# EAGLE design LED Debug - CRBFH0 (EAGLE 9.2.2)
LICENSE: CERN OHL; REV: CRBFH0; TITLE: LED Debug; URL: https://github.com/CapableRobot/PMOD-Adapters
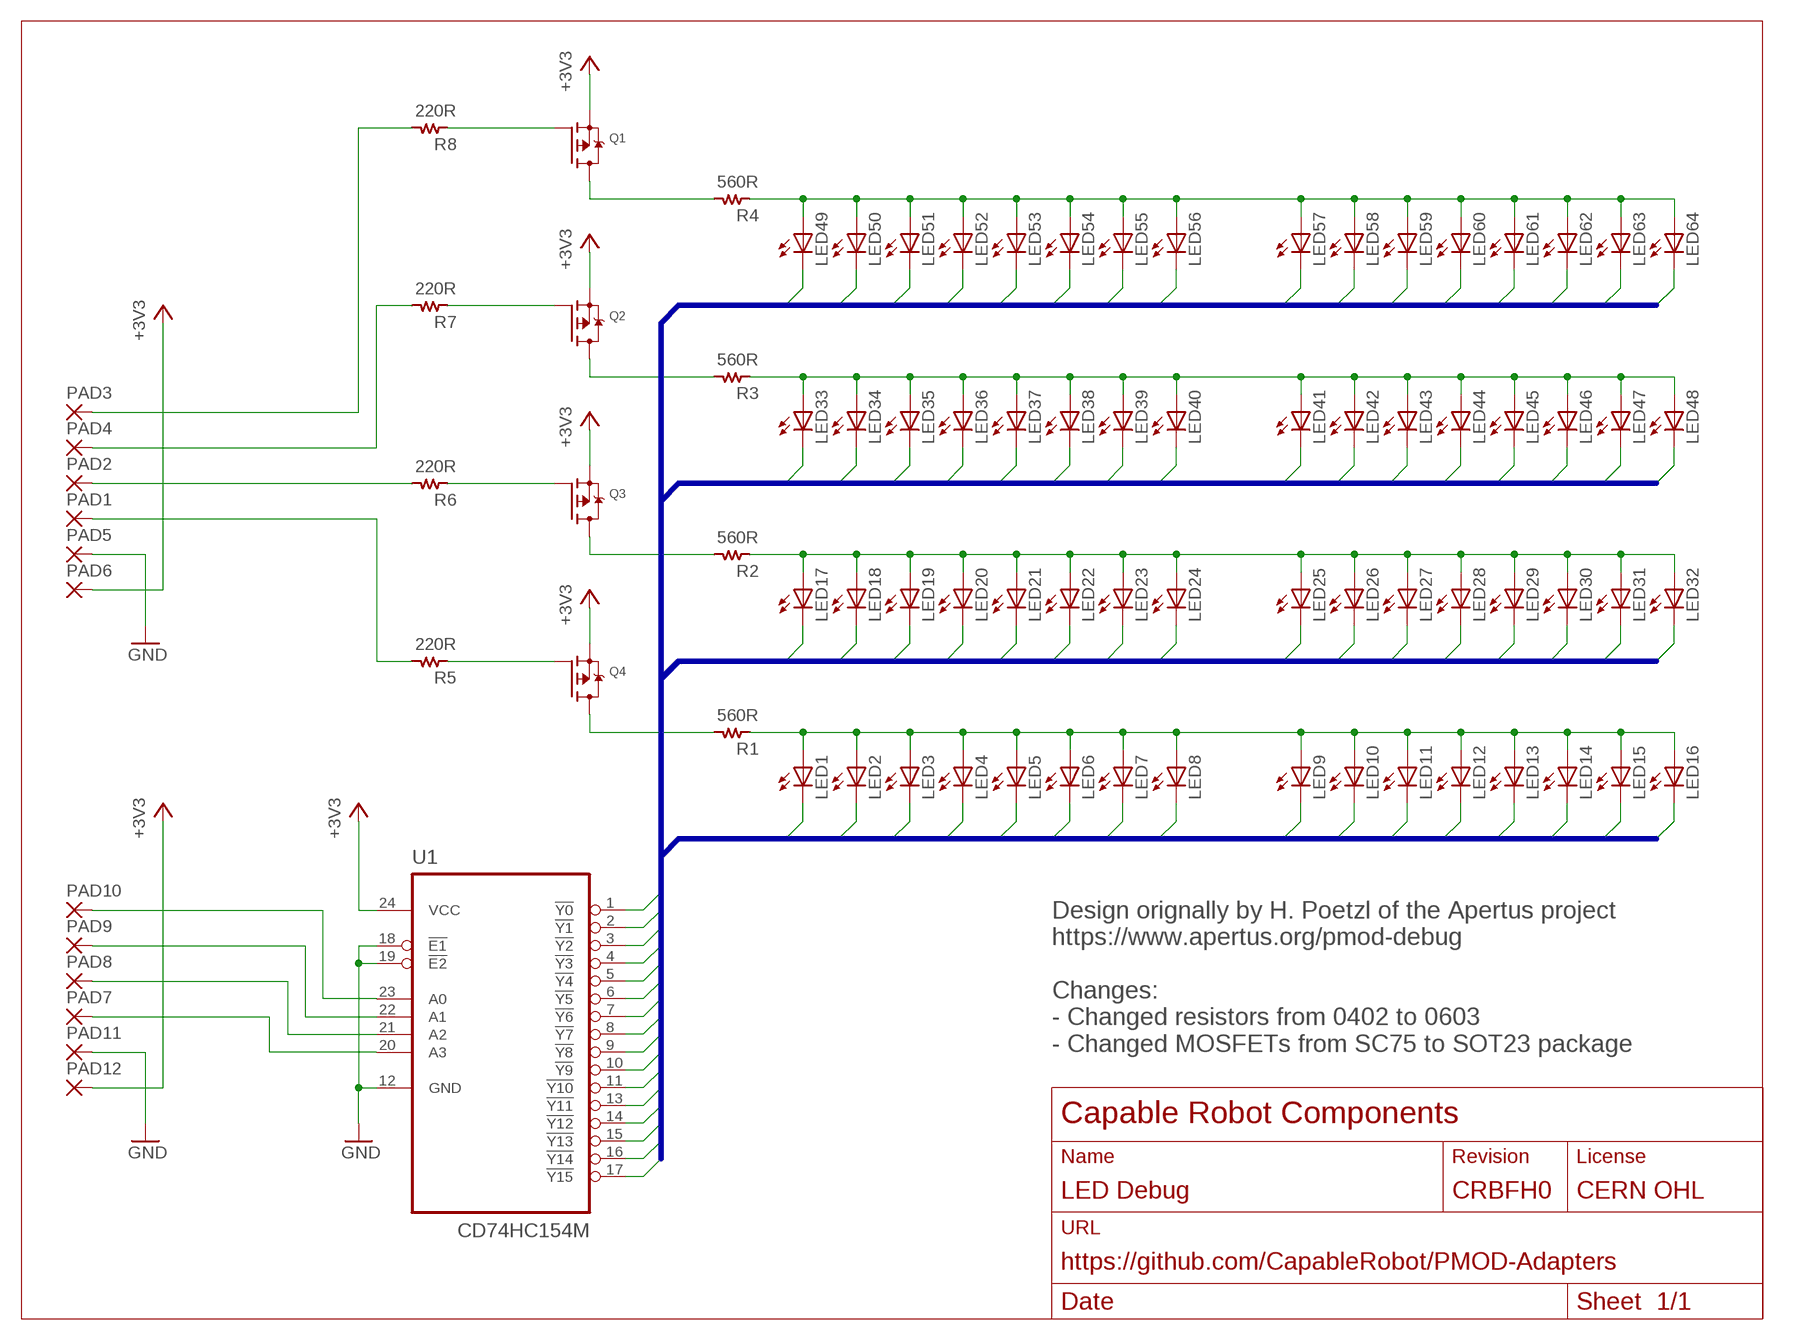
[diagram p0: schematic, sheet 1]

## Parts
LED1  LEDCHIP-LED0603  [CHIP-LED0603]
LED2  LEDCHIP-LED0603  [CHIP-LED0603]
LED3  LEDCHIP-LED0603  [CHIP-LED0603]
LED4  LEDCHIP-LED0603  [CHIP-LED0603]
LED5  LEDCHIP-LED0603  [CHIP-LED0603]
LED6  LEDCHIP-LED0603  [CHIP-LED0603]
LED7  LEDCHIP-LED0603  [CHIP-LED0603]
LED8  LEDCHIP-LED0603  [CHIP-LED0603]
LED9  LEDCHIP-LED0603  [CHIP-LED0603]
LED10  LEDCHIP-LED0603  [CHIP-LED0603]
LED11  LEDCHIP-LED0603  [CHIP-LED0603]
LED12  LEDCHIP-LED0603  [CHIP-LED0603]
LED13  LEDCHIP-LED0603  [CHIP-LED0603]
LED14  LEDCHIP-LED0603  [CHIP-LED0603]
LED15  LEDCHIP-LED0603  [CHIP-LED0603]
LED16  LEDCHIP-LED0603  [CHIP-LED0603]
LED17  LEDCHIP-LED0603  [CHIP-LED0603]
LED18  LEDCHIP-LED0603  [CHIP-LED0603]
LED19  LEDCHIP-LED0603  [CHIP-LED0603]
LED20  LEDCHIP-LED0603  [CHIP-LED0603]
LED21  LEDCHIP-LED0603  [CHIP-LED0603]
LED22  LEDCHIP-LED0603  [CHIP-LED0603]
LED23  LEDCHIP-LED0603  [CHIP-LED0603]
LED24  LEDCHIP-LED0603  [CHIP-LED0603]
LED25  LEDCHIP-LED0603  [CHIP-LED0603]
LED26  LEDCHIP-LED0603  [CHIP-LED0603]
LED27  LEDCHIP-LED0603  [CHIP-LED0603]
LED28  LEDCHIP-LED0603  [CHIP-LED0603]
LED29  LEDCHIP-LED0603  [CHIP-LED0603]
LED30  LEDCHIP-LED0603  [CHIP-LED0603]
LED31  LEDCHIP-LED0603  [CHIP-LED0603]
LED32  LEDCHIP-LED0603  [CHIP-LED0603]
LED33  LEDCHIP-LED0603  [CHIP-LED0603]
LED34  LEDCHIP-LED0603  [CHIP-LED0603]
LED35  LEDCHIP-LED0603  [CHIP-LED0603]
LED36  LEDCHIP-LED0603  [CHIP-LED0603]
LED37  LEDCHIP-LED0603  [CHIP-LED0603]
LED38  LEDCHIP-LED0603  [CHIP-LED0603]
LED39  LEDCHIP-LED0603  [CHIP-LED0603]
LED40  LEDCHIP-LED0603  [CHIP-LED0603]
LED41  LEDCHIP-LED0603  [CHIP-LED0603]
LED42  LEDCHIP-LED0603  [CHIP-LED0603]
LED43  LEDCHIP-LED0603  [CHIP-LED0603]
LED44  LEDCHIP-LED0603  [CHIP-LED0603]
LED45  LEDCHIP-LED0603  [CHIP-LED0603]
LED46  LEDCHIP-LED0603  [CHIP-LED0603]
LED47  LEDCHIP-LED0603  [CHIP-LED0603]
LED48  LEDCHIP-LED0603  [CHIP-LED0603]
LED49  LEDCHIP-LED0603  [CHIP-LED0603]
LED50  LEDCHIP-LED0603  [CHIP-LED0603]
LED51  LEDCHIP-LED0603  [CHIP-LED0603]
LED52  LEDCHIP-LED0603  [CHIP-LED0603]
LED53  LEDCHIP-LED0603  [CHIP-LED0603]
LED54  LEDCHIP-LED0603  [CHIP-LED0603]
LED55  LEDCHIP-LED0603  [CHIP-LED0603]
LED56  LEDCHIP-LED0603  [CHIP-LED0603]
LED57  LEDCHIP-LED0603  [CHIP-LED0603]
LED58  LEDCHIP-LED0603  [CHIP-LED0603]
LED59  LEDCHIP-LED0603  [CHIP-LED0603]
LED60  LEDCHIP-LED0603  [CHIP-LED0603]
LED61  LEDCHIP-LED0603  [CHIP-LED0603]
LED62  LEDCHIP-LED0603  [CHIP-LED0603]
LED63  LEDCHIP-LED0603  [CHIP-LED0603]
LED64  LEDCHIP-LED0603  [CHIP-LED0603]
PAD1  SMD2HR  [SMD1.27-3.175HR]
PAD2  SMD2HR  [SMD1.27-3.175HR]
PAD3  SMD2HR  [SMD1.27-3.175HR]
PAD4  SMD2HR  [SMD1.27-3.175HR]
PAD5  SMD2HR  [SMD1.27-3.175HR]
PAD6  SMD2HR  [SMD1.27-3.175HR]
PAD7  SMD2HR  [SMD1.27-3.175HR]
PAD8  SMD2HR  [SMD1.27-3.175HR]
PAD9  SMD2HR  [SMD1.27-3.175HR]
PAD10  SMD2HR  [SMD1.27-3.175HR]
PAD11  SMD2HR  [SMD1.27-3.175HR]
PAD12  SMD2HR  [SMD1.27-3.175HR]
Q1  MOSFET-P  [SOT23-R]
Q2  MOSFET-P  [SOT23-R]
Q3  MOSFET-P  [SOT23-R]
Q4  MOSFET-P  [SOT23-R]
R1  560R  RES0603  [0603]
R2  560R  RES0603  [0603]
R3  560R  RES0603  [0603]
R4  560R  RES0603  [0603]
R5  220R  RES0603  [0603]
R6  220R  RES0603  [0603]
R7  220R  RES0603  [0603]
R8  220R  RES0603  [0603]
U1  CD74HC154M  [SOIC127P1030X265-24N]

## Nets
+3V3: PAD6.1(P) PAD12.1(P) Q1.2(S) Q2.2(S) Q3.2(S) Q4.2(S) U1.24(VCC)
C0: LED1.C LED17.C LED33.C LED49.C U1.1(!Y0)
C1: LED2.C LED18.C LED34.C LED50.C U1.2(!Y1)
C2: LED3.C LED19.C LED35.C LED51.C U1.3(!Y2)
C3: LED4.C LED20.C LED36.C LED52.C U1.4(!Y3)
C4: LED5.C LED21.C LED37.C LED53.C U1.5(!Y4)
C5: LED6.C LED22.C LED38.C LED54.C U1.6(!Y5)
C6: LED7.C LED23.C LED39.C LED55.C U1.7(!Y6)
C7: LED8.C LED24.C LED40.C LED56.C U1.8(!Y7)
C8: LED9.C LED25.C LED41.C LED57.C U1.9(!Y8)
C9: LED10.C LED26.C LED42.C LED58.C U1.10(!Y9)
C10: LED11.C LED27.C LED43.C LED59.C U1.11(!Y10)
C11: LED12.C LED28.C LED44.C LED60.C U1.13(!Y11)
C12: LED13.C LED29.C LED45.C LED61.C U1.14(!Y12)
C13: LED14.C LED30.C LED46.C LED62.C U1.15(!Y13)
C14: LED15.C LED31.C LED47.C LED63.C U1.16(!Y14)
C15: LED16.C LED32.C LED48.C LED64.C U1.17(!Y15)
GND: PAD5.1(P) PAD11.1(P) U1.12(GND) U1.18(!E1) U1.19(!E2)
N$1: LED1.A LED2.A LED3.A LED4.A LED5.A LED6.A LED7.A LED8.A LED9.A LED10.A LED11.A LED12.A LED13.A LED14.A LED15.A LED16.A R1.1
N$2: LED17.A LED18.A LED19.A LED20.A LED21.A LED22.A LED23.A LED24.A LED25.A LED26.A LED27.A LED28.A LED29.A LED30.A LED31.A LED32.A R2.1
N$3: LED33.A LED34.A LED35.A LED36.A LED37.A LED38.A LED39.A LED40.A LED41.A LED42.A LED43.A LED44.A LED45.A LED46.A LED47.A LED48.A R3.1
N$4: LED49.A LED50.A LED51.A LED52.A LED53.A LED54.A LED55.A LED56.A LED57.A LED58.A LED59.A LED60.A LED61.A LED62.A LED63.A LED64.A R4.1
N$5: Q1.3(D) R4.2
N$6: Q2.3(D) R3.2
N$7: Q4.3(D) R1.2
N$8: Q3.3(D) R2.2
N$9: Q1.1(G) R8.1
N$10: Q2.1(G) R7.1
N$11: Q4.1(G) R5.1
N$12: Q3.1(G) R6.1
N$13: PAD10.1(P) U1.23(A0)
N$14: PAD9.1(P) U1.22(A1)
N$15: PAD8.1(P) U1.21(A2)
N$16: PAD7.1(P) U1.20(A3)
N$17: PAD1.1(P) R5.2
N$18: PAD2.1(P) R6.2
N$19: PAD3.1(P) R8.2
N$20: PAD4.1(P) R7.2

## Buses
C[0..15]

## Notes on the sheet
- Design orignally by H. Poetzl of the Apertus project
  https://www.apertus.org/pmod-debug
  
  Changes:
  - Changed resistors from 0402 to 0603
  - Changed MOSFETs from SC75 to SOT23 package

## Library data of the parts
LED1-LED64 = led:LED: LED OSRAM: - CHIPLED LG R971, LG N971, LY N971, LG Q971, LY Q971, LO R971, LY R971 LH N974, LH R974 LS Q976, LO Q976, LY Q976 LO Q996 - Hyper CHIPLED LW Q18S LB Q993, LB Q99A, LB R99A - SideLED LS A670, LO A670, LY A670, LG A670, LP A670 LB A673, LV A673, LT A673, LW A673 LH A674 LY A675 LS A676, LA A676, LO A676, LY A676, LW A676 LS A679, LY A679, LG A679 - Hyper Micro SIDELED® LS Y876, LA Y876, LO Y876, LY Y876 LT Y87S - SmartLED LW L88C, LW L88S LB L89C, LB L89S, LG L890 LS L89K, LO L89K, LY L89K LS L896, LA L896, LO L896, LY L896 - TOPLED LS T670, LO T670, LY T670, LG T670, LP T670 LSG T670, LSP T670, LSY T670, LOP T670, LYG T670 LG T671, LOG T671, LSG T671 LB T673, LV T673, LT T673, LW T673 LH T674 LS T676, LA T676, LO T676, LY T676, LB T676, LH T676, LSB T676, LW T676 LB T67C, LV T67C, LT T67C, LS T67K, LO T67K, LY T67K, LW E67C LS E67B, LA E67B, LO E67B, LY E67B, LB E67C, LV E67C, LT E67C LW T67C LS T679, LY T679, LG T679 LS T770, LO T770, LY T770, LG T770, LP T770 LB T773, LV T773, LT T773, LW T773 LH T774 LS E675, LA E675, LY E675, LS T675 LS T776, LA T776, LO T776, LY T776, LB T776 LHGB T686 LT T68C, LB T68C - Hyper Mini TOPLED® LB M676 - Mini TOPLED Santana® LG M470 LS M47K, LO M47K, LY M47K Source: http://www.osram.convergy.de LUXEON: - LUMILED® LXK2-PW12-R00, LXK2-PW12-S00, LXK2-PW14-U00, LXK2-PW14-V00 LXK2-PM12-R00, LXK2-PM12-S00, LXK2-PM14-U00 LXK2-PE12-Q00, LXK2-PE12-R00, LXK2-PE12-S00, LXK2-PE14-T00, LXK2-PE14-U00 LXK2-PB12-K00, LXK2-PB12-L00, LXK2-PB12-M00, LXK2-PB14-N00, LXK2-PB14-P00, LXK2-PB14-Q00 LXK2-PR12-L00, LXK2-PR12-M00, LXK2-PR14-Q00, LXK2-PR14-R00 LXK2-PD12-Q00, LXK2-PD12-R00, LXK2-PD12-S00 LXK2-PH12-R00, LXK2-PH12-S00 LXK2-PL12-P00, LXK2-PL12-Q00, LXK2-PL12-R00 Source: www.luxeon.com KINGBRIGHT: KA-3528ASYC Source: www.kingbright.com
PAD1-PAD12 = wirepad:SMD2: SMD PAD
Q1-Q4 = microbuilder:MOSFET-P: P-Channel Mosfet LEGEND VDS: Voltage Drain-Source ID: Drain Current RDS(ON): Drain-Source On-State Resistance VGS(TH): Gate-Source Threshold Voltage CISS: Drain-Source Input Capacitance SOT-23 Name VDS ID RDS(ON) VGS(TH) CISS Order Number IRLML5103 30V 760mA 600 mOhm -- 75pF @ 25V Digikey: IRLML5103PBFCT-ND IRLML6401 12V 4.3A 50 mOhm 950mV @ 250µA 830pF @ 10V Digikey: IRLML6401PBFTR-ND NTR0202PL 20V 400mA 800 mOhm 2.3V @ 250uA 70pF @ 5V Digikey: NTR0202PLT1GOSTR-ND NTR4101PT1G 20V 1.8A 85 mOhm 1.2V @ 250uA 675pF @ 10V Digikey: NTR4101PT1GOSCT-ND DMP2004K 20V 600mA 900 mOhm 1V @ 250uA 175pF @ 16V Digikey: DMP2004KDICT-ND PMV65XP 20V 3.9A 76 mOhm 950mV @ 1mA 725pF @ 20V Digikey: 568-2358-2-ND TO-252 Name VDS ID RDS(ON) VGS(TH) CISS Order Number AOD417 30V 25A 34 mOhm 3V @ 250µA 920pF @ 15V Digikey: 785-1106-2-ND
R1-R8 = CapableRobot:RES
U1 = 74hc154:CD74HC154M: High-Speed CMOS Logic 4- to 16-Line Decoder/Demultiplexer; MPN: CD74HC154M; OC_FARNELL: 1640550; OC_NEWARK: 66F5185; PACKAGE: SOIC-24; SUPPLIER: Texas Instruments

## Board
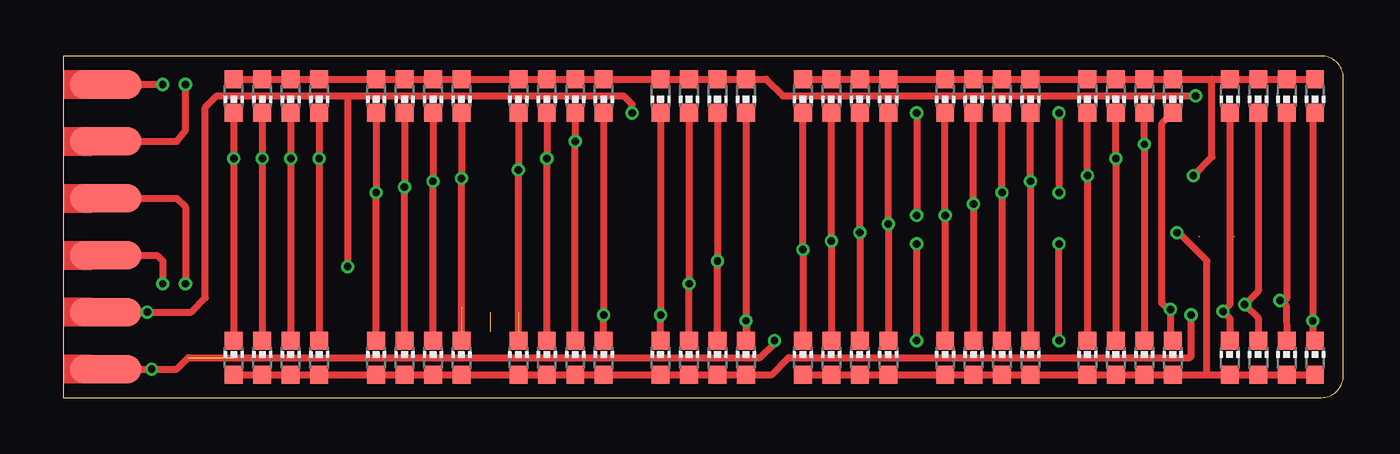
[diagram p1: board, top side]
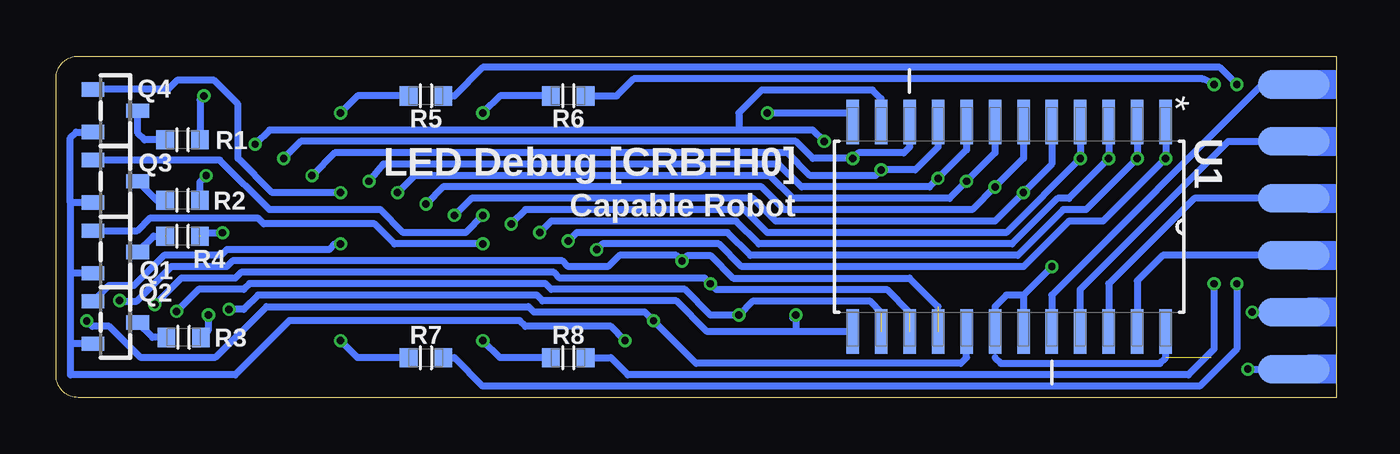
[diagram p2: board, bottom side, seen from below]

Size 57.15 x 15.24 mm. Coordinates in mm from the lower left corner, seen from the top.
Outline: 0,0 56.15,0 arc90 57.15,1 57.15,14.24 arc90 56.15,15.24 0,15.24 0,0
Copper layers (1*16): Top 0.035559375mm / dielectric 1.6mm / Bottom 0.035559375mm
Design rules "oshpark-2layer *": minimum track width 6mil, minimum drill 10mil, track to track 6mil, track to pad 6mil, pad to pad 6mil, via to via 6mil, smd to smd 6mil, copper to edge 15mil, drill to drill 6mil, minimum pad ring 5mil, minimum via ring 5mil, stop-mask expansion 2.5mil, vias tented up to drill 50mil, thermal gap 10mil

### Footprints (pad centres in the part's own frame; a part is rotated, then mirrored left to right if it is on the bottom)
CHIP-LED0603 = smd 0.8 x 0.8: A 0,-0.75; C 0,0.75
SMD1.27-3.175HR = smd 1.27 x 3.175: 1 0,0
SOT23-R = smd 0.635 x 1.016: 1 -0.95,-1; 2 0.95,-1; 3 0,1
0603 = smd 0.79 x 0.86: 1 -0.775,0; 2 0.775,0
SOIC127P1030X265-24N = smd 1.981 x 0.559: 1 -4.674,6.985; 2 -4.674,5.715; 3 -4.674,4.445; 4 -4.674,3.175; 5 -4.674,1.905; 6 -4.674,0.635; 7 -4.674,-0.635; 8 -4.674,-1.905; 9 -4.674,-3.175; 10 -4.674,-4.445; 11 -4.674,-5.715; 12 -4.674,-6.985; 13 4.674,-6.985; 14 4.674,-5.715; 15 4.674,-4.445; 16 4.674,-3.175; 17 4.674,-1.905; 18 4.674,-0.635; 19 4.674,0.635; 20 4.674,1.905; 21 4.674,3.175; 22 4.674,4.445; 23 4.674,5.715; 24 4.674,6.985

### Placement (x,y rotation side)
LED1  7.62,13.46 180 top
LED2  8.89,13.46 180 top
LED3  10.16,13.46 180 top
LED4  11.43,13.46 180 top
LED5  13.97,13.46 180 top
LED6  15.24,13.46 180 top
LED7  16.51,13.46 180 top
LED8  17.78,13.46 180 top
LED9  20.32,13.46 180 top
LED10  21.59,13.46 180 top
LED11  22.86,13.46 180 top
LED12  24.13,13.46 180 top
LED13  26.67,13.46 180 top
LED14  27.94,13.46 180 top
LED15  29.21,13.46 180 top
LED16  30.48,13.46 180 top
LED17  33.02,13.46 180 top
LED18  34.29,13.46 180 top
LED19  35.56,13.46 180 top
LED20  36.83,13.46 180 top
LED21  39.37,13.46 180 top
LED22  40.64,13.46 180 top
LED23  41.91,13.46 180 top
LED24  43.18,13.46 180 top
LED25  45.72,13.46 180 top
LED26  46.99,13.46 180 top
LED27  48.26,13.46 180 top
LED28  49.53,13.46 180 top
LED29  52.07,13.46 180 top
LED30  53.34,13.46 180 top
LED31  54.61,13.46 180 top
LED32  55.88,13.46 180 top
LED33  7.62,1.78 0 top
LED34  8.89,1.78 0 top
LED35  10.16,1.78 0 top
LED36  11.43,1.78 0 top
LED37  13.97,1.78 0 top
LED38  15.24,1.78 0 top
LED39  16.51,1.78 0 top
LED40  17.78,1.78 0 top
LED41  20.32,1.78 0 top
LED42  21.59,1.78 0 top
LED43  22.86,1.78 0 top
LED44  24.13,1.78 0 top
LED45  26.67,1.78 0 top
LED46  27.94,1.78 0 top
LED47  29.21,1.78 0 top
LED48  30.48,1.78 0 top
LED49  33.02,1.78 0 top
LED50  34.29,1.78 0 top
LED51  35.56,1.78 0 top
LED52  36.83,1.78 0 top
LED53  39.37,1.78 0 top
LED54  40.64,1.78 0 top
LED55  41.91,1.78 0 top
LED56  43.18,1.78 0 top
LED57  45.72,1.78 0 top
LED58  46.99,1.78 0 top
LED59  48.26,1.78 0 top
LED60  49.53,1.78 0 top
LED61  52.07,1.78 0 top
LED62  53.34,1.78 0 top
LED63  54.61,1.78 0 top
LED64  55.88,1.78 0 top
PAD1  1.91,13.97 270 top
PAD2  1.91,11.43 270 top
PAD3  1.91,8.89 270 top
PAD4  1.91,6.35 270 top
PAD5  1.91,3.81 270 top
PAD6  1.91,1.27 270 top
PAD7  1.91,13.97 90 bottom
PAD8  1.91,11.43 90 bottom
PAD9  1.91,8.89 90 bottom
PAD10  1.91,6.35 90 bottom
PAD11  1.91,3.81 90 bottom
PAD12  1.91,1.27 90 bottom
Q1  54.5,6.5 270 bottom
Q2  54.5,3.35 270 bottom
Q3  54.5,9.65 270 bottom
Q4  54.5,12.8 270 bottom
R1  51.5,11.5 180 bottom
R2  51.5,8.8 180 bottom
R3  51.45,2.69 180 bottom
R4  51.5,7.2 180 bottom
R5  40.64,13.46 0 bottom
R6  34.29,13.46 0 bottom
R7  40.64,1.78 0 bottom
R8  34.29,1.78 0 bottom
U1  14.61,7.62 270 bottom

### Tracks (layer width: path | path; a pad name or v marks a point on that pad's centre or on a via)
+3V3  (via drill 0.33)  (1 unrouted)
  Top 0.305: PAD12.1 v3.96,1.27 5.08,1.27 5.59,1.78 31.11,1.78 31.75,2.41 v31.75,2.54
  Bottom 0.305: 15.24,1.78 14.99,1.52 7.87,1.52 7.62,1.78 U1.24 | v3.96,1.27 PAD12.1 | 56.52,5.55 56.52,2.4 | 56.52,2.4 56.52,1.02 49.15,1.02 46.74,3.43 36.45,3.43 36.2,3.17 32.38,3.17 v31.75,2.54 | Q1.2 56.52,5.55 | Q2.2 56.52,2.4 | Q3.2 56.52,8.7 | 56.52,8.7 56.52,5.55 | Q4.2 56.25,11.85 56.52,11.59 56.52,8.7
C0  (via drill 0.33)
  Top 0.305: LED1.C v7.62,10.67 LED33.C | LED17.C v33.02,6.6 LED49.C
  Bottom 0.305: v33.02,6.6 32.77,6.86 27.56,6.86 26.54,5.84 13.97,5.84 11.94,7.87 10.41,7.87 v7.62,10.67 U1.1
C1  (via drill 0.33)
  Top 0.305: LED2.C v8.89,10.67 LED34.C | LED18.C v34.29,6.99 LED50.C
  Bottom 0.305: v34.29,6.99 33.91,7.37 27.18,7.37 26.16,6.35 14.22,6.35 12.19,8.38 11.18,8.38 v8.89,10.67 U1.2
C2  (via drill 0.33)
  Top 0.305: LED3.C v10.16,10.67 LED35.C | LED19.C v35.56,7.37 LED51.C
  Bottom 0.305: v35.56,7.37 35.05,7.87 26.8,7.87 25.78,6.86 14.48,6.86 12.45,8.89 11.94,8.89 v10.16,10.67 U1.3
C3  (via drill 0.33)
  Top 0.305: LED4.C v11.43,10.67 LED36.C | LED20.C v36.83,7.75 LED52.C
  Bottom 0.305: v36.83,7.75 36.2,8.38 26.42,8.38 25.4,7.37 14.73,7.37 v11.43,10.67 U1.4
C4  (via drill 0.33)
  Top 0.305: LED5.C v13.97,9.14 LED37.C | LED21.C v39.37,8.13 LED53.C
  Bottom 0.305: v39.37,8.13 38.61,8.89 26.04,8.89 25.02,7.87 15.24,7.87 v13.97,9.14 12.7,10.41 U1.5
C5  (via drill 0.33)
  Top 0.305: LED6.C v15.24,9.4 LED38.C | LED22.C v40.64,8.64 LED54.C
  Bottom 0.305: v40.64,8.64 39.88,9.4 25.65,9.4 24.64,8.38 16.26,8.38 v15.24,9.4 13.97,10.67 U1.6
C6  (via drill 0.33)
  Top 0.305: LED7.C v16.51,9.65 LED39.C | LED23.C v41.91,9.14 LED55.C
  Bottom 0.305: v41.91,9.14 41.15,9.91 25.27,9.91 24.26,8.89 17.27,8.89 v16.51,9.65 15.24,10.92 U1.7
C7  (via drill 0.33)
  Top 0.305: LED8.C v17.78,9.78 LED40.C | LED24.C v43.18,9.65 LED56.C
  Bottom 0.305: v43.18,9.65 42.55,10.41 24.89,10.41 23.88,9.4 18.16,9.4 v17.78,9.78 16.51,11.05 U1.8
C8  (via drill 0.33)
  Top 0.305: LED9.C v20.32,10.16 LED41.C | LED25.C v45.72,9.91 LED57.C
  Bottom 0.305: v45.72,9.91 44.7,10.92 24.51,10.92 23.5,9.91 20.57,9.91 v20.32,10.16 18.8,10.16 17.78,11.18 U1.9
C9  (via drill 0.33)
  Top 0.305: LED10.C v21.59,10.67 LED42.C | LED26.C v46.99,10.67 LED58.C
  Bottom 0.305: v46.99,10.67 46.23,11.43 24.13,11.43 23.37,10.67 v21.59,10.67 21.34,10.92 19.3,10.92 19.05,11.18 U1.10
C10  (via drill 0.33)
  Top 0.305: LED11.C v22.86,11.43 LED43.C | LED27.C v48.26,11.3 LED59.C
  Bottom 0.305: v22.86,11.43 23.37,11.94 26.67,11.94 | 26.67,11.94 47.62,11.94 v48.26,11.3 | U1.11 20.32,13.34 20.7,13.72 25.65,13.72 26.67,12.7 26.67,11.94
C11  (via drill 0.33)
  Top 0.305: LED12.C v24.13,3.68 LED44.C | LED28.C 49.03,12.21 49.03,4.24 49.33,3.94 v49.43,3.94 49.43,2.63 LED60.C
  Bottom 0.305: 24.26,3.56 v24.13,3.68 24.13,2.95 | v49.43,3.94 48.77,3.94 48.13,4.57 35.69,4.57 35.43,4.32 29.46,4.32 28.09,2.95 24.13,2.95 | U1.13 24.13,2.95
C12  (via drill 0.33)  (1 unrouted)
  Top 0.305: LED45.C v26.67,3.68 LED13.C | LED61.C 52.07,3.54 v51.77,3.85 52.07,4.14 LED29.C
  Bottom 0.305: 20.32,3.81 20.83,4.32 26.04,4.32 v26.67,3.68 27.94,3.68 29.08,4.83 35.05,4.83 35.31,5.08 48.51,5.08 48.77,4.83 50.79,4.83 v51.77,3.85
C13  (via drill 0.33)  (1 unrouted)
  Top 0.305: LED46.C v27.94,5.08 LED14.C | LED62.C 53.34,3.55 v52.74,4.15 53.34,4.75 LED30.C
  Bottom 0.305: 19.05,3.81 20.07,4.83 27.69,4.83 v27.94,5.08 28.19,5.33 34.67,5.33 34.92,5.59 48.9,5.59 49.15,5.33 51.56,5.33 v52.74,4.15
C14  (via drill 0.33)  (1 unrouted)
  Top 0.305: LED47.C v29.21,6.1 LED15.C | LED63.C 54.59,4.1 v54.31,4.33 54.51,4.32 54.61,4.41 LED31.C
  Bottom 0.305: 17.78,4.06 19.05,5.33 26.92,5.33 27.94,6.35 28.96,6.35 v29.21,6.1 29.46,6.35 32,6.35 32.51,5.84 34.29,5.84 34.54,6.1 49.28,6.1 49.53,5.84 52,5.84 53.54,4.3 54.28,4.3 v54.31,4.33
C15  (via drill 0.33)
  Top 0.305: LED16.C v30.48,3.43 | v30.48,3.43 LED48.C 30.49,3.3 30.48,3.31 v30.48,3.43 | LED32.C 55.78,12.61 v55.78,3.43 55.78,2.63 LED64.C
  Bottom 0.305: v55.78,3.43 55.53,3.17 55.5,3.2 54.8,3.2 53.4,1.8 50.02,1.8 47.75,4.06 36.07,4.06 35.81,3.81 30.86,3.81 v30.48,3.43 28.57,1.52 16.76,1.52 16.51,1.78 U1.17
GND  (via drill 0.33)
  Top 0.305: PAD11.1 v3.76,3.81 5.71,3.81 6.35,4.45 6.35,12.95 6.86,13.46 12.7,13.46 | 12.7,13.46 25.02,13.46 25.4,13.08 v25.4,12.7 | 12.7,13.46 v12.7,5.84
  Bottom 0.305: v3.76,3.81 PAD11.1 | v25.4,12.7 21.59,12.7 U1.12 | v12.7,5.84 13.97,4.57 | 13.97,4.57 U1.19 | 13.97,4.57 14.73,4.57 15.24,4.06 U1.18
N$1  (via drill 0.33)
  Top 0.305: v50.55,13.46 32.13,13.46 31.38,14.21 LED16.A LED15.A LED14.A LED13.A LED12.A LED11.A LED10.A LED9.A LED8.A LED7.A LED6.A LED5.A LED4.A LED3.A LED1.A LED2.A
  Bottom 0.305: v50.55,13.46 50.73,13.28 R1.1
N$2  (via drill 0.33)
  Top 0.305: LED32.A LED31.A LED30.A LED29.A 51.28,14.21 | LED20.A LED19.A LED18.A LED17.A LED21.A LED22.A LED23.A LED24.A LED25.A LED26.A LED27.A LED28.A 51.28,14.21 | v50.45,9.9 51.28,10.74 51.28,14.21
  Bottom 0.305: v50.45,9.9 50.73,9.62 R2.1
N$3  (via drill 0.33)
  Top 0.305: v50.35,3.69 50.35,1.83 50.29,1.78 32.38,1.78 31.64,1.03 LED48.A LED47.A LED46.A LED45.A LED44.A LED43.A LED42.A LED41.A LED40.A LED39.A LED38.A LED37.A LED36.A LED35.A LED34.A LED33.A
  Bottom 0.305: R3.1 50.35,3.02 v50.35,3.69
N$4  (via drill 0.33)  (1 unrouted)
  Top 0.305: LED61.A 51.05,1.03 51.05,6.1 49.8,7.36 v49.72,7.36 | LED51.A LED50.A LED49.A LED52.A LED53.A LED54.A LED55.A LED56.A LED57.A LED58.A LED59.A LED60.A LED61.A | LED61.A LED62.A LED63.A LED64.A
  Bottom 0.305: 50.7,7.2 50.55,7.36 v49.72,7.36
N$5  (1 unrouted)
  Bottom 0.305: Q1.3 52.8,7.2 52.25,7.2
N$6
  Bottom 0.305: R3.2 52.84,2.69 Q2.3
N$7
  Bottom 0.305: Q4.3 53.5,11.8 53.2,11.5 R1.2
N$8
  Bottom 0.305: Q3.3 52.65,8.8 R2.2
N$9  (via drill 0.33)
  Top 0.305: v38.1,2.54 v38.1,6.86
  Bottom 0.305: R8.1 37.34,1.78 v38.1,2.54 | v38.1,6.86 42.04,6.86 42.93,7.75 47.88,7.75 48.15,8.02 52.94,8.02 53.51,7.45 Q1.1
N$10  (via drill 0.33)
  Top 0.305: v44.45,2.54 v44.45,6.86
  Bottom 0.305: R7.1 43.69,1.78 v44.45,2.54 | Q2.1 54.87,4.93 54.79,5 53.67,5 52.32,6.35 49.78,6.35 49.53,6.6 44.96,6.6 44.7,6.86 v44.45,6.86
N$11  (via drill 0.33)
  Top 0.305: v44.45,12.7 v44.45,9.14
  Bottom 0.305: R5.1 43.69,13.46 v44.45,12.7 | v44.45,9.14 47.5,9.14 49.02,10.67 49.02,13.08 50.09,14.15 51.75,14.15 52.15,13.75 Q4.1
N$12  (via drill 0.33)
  Top 0.305: v38.1,12.7 v38.1,8.13
  Bottom 0.305: R6.1 37.34,13.46 v38.1,12.7 | v38.1,8.13 38.86,7.37 41.66,7.37 42.67,8.38 47.62,8.38 49.84,10.6 Q3.1
N$13
  Bottom 0.305: PAD10.1 7.75,6.35 8.89,5.21 U1.23
N$14
  Bottom 0.305: PAD9.1 6.35,8.89 10.16,5.08 U1.22
N$15
  Bottom 0.305: U1.21 11.43,4.83 4.83,11.43 PAD8.1
N$16
  Bottom 0.305: PAD7.1 3.3,13.97 12.7,4.57 U1.20
N$17  (via drill 0.33)
  Top 0.305: PAD1.1 v4.45,13.97
  Bottom 0.305: v4.45,13.97 5.21,14.73 38.1,14.73 39.37,13.46 R5.2
N$18  (via drill 0.33)
  Top 0.305: PAD2.1 5.08,11.43 5.46,11.94 v5.46,13.97
  Bottom 0.305: v5.46,13.97 5.97,14.22 31.37,14.22 32.13,13.46 R6.2
N$19  (via drill 0.33)
  Top 0.305: PAD3.1 5.08,8.89 5.46,8.51 v5.46,5.08
  Bottom 0.305: v5.46,5.08 5.46,2.16 6.6,1.02 31.62,1.02 32.38,1.78 R8.2
N$20  (via drill 0.33)
  Top 0.305: PAD4.1 4.19,6.35 4.45,6.1 v4.45,5.08
  Bottom 0.305: v4.45,5.08 4.45,2.16 6.1,0.51 38.1,0.51 39.37,1.78 R7.2

### Text on the board
bPlace: LED Debug [CRBFH0] | Capable Robot